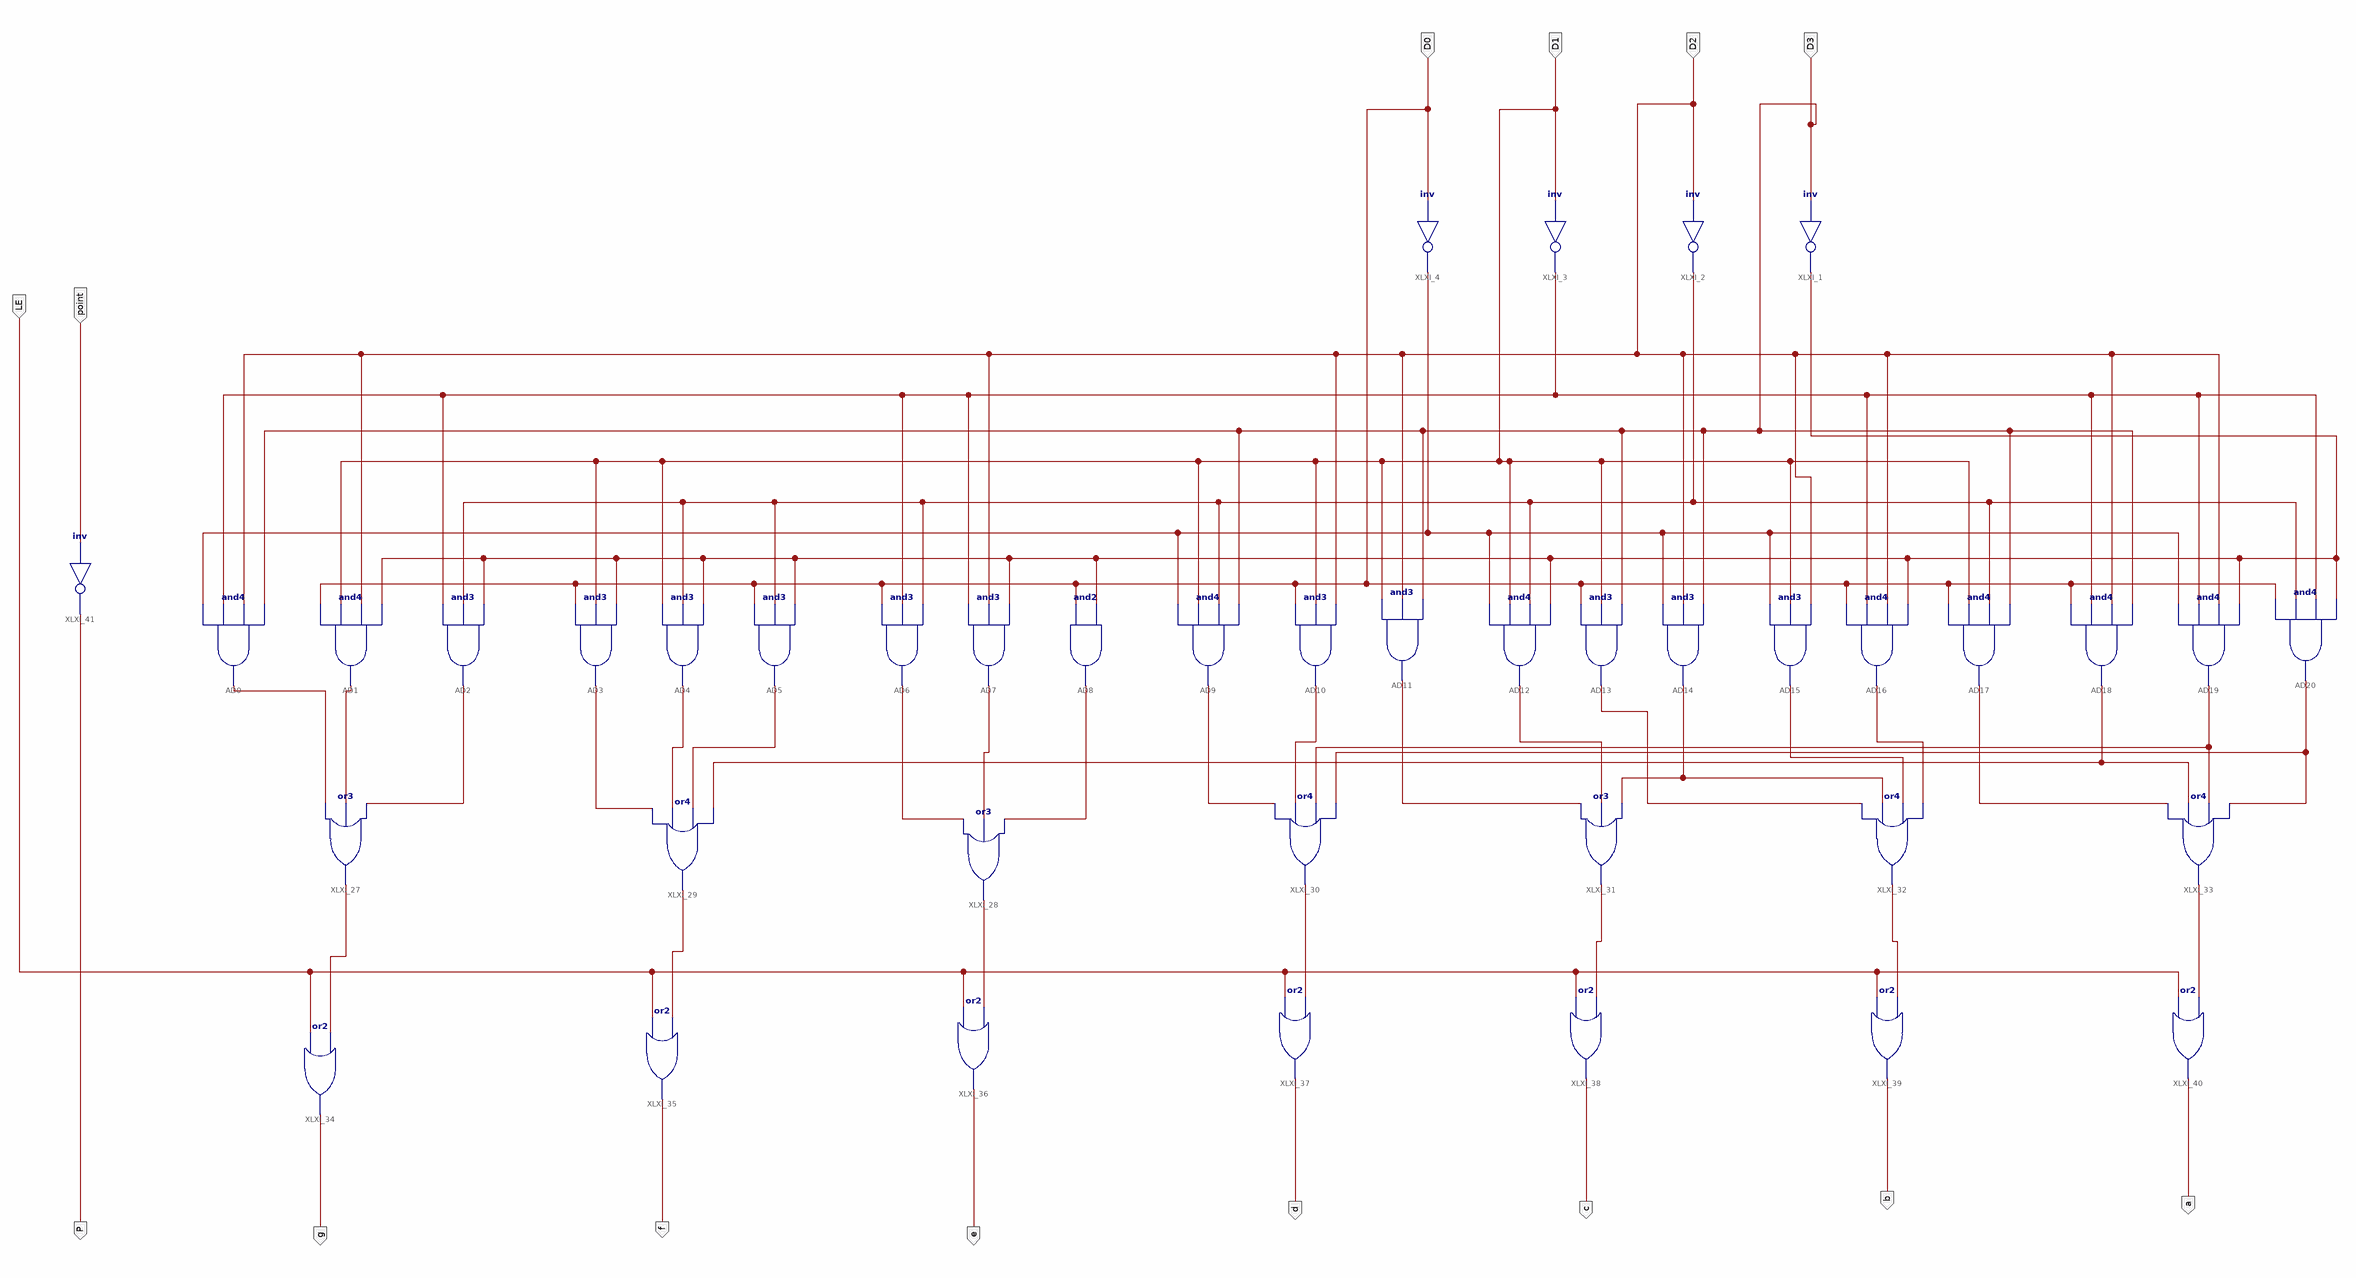
[diagram p0: schematic sheet 1]
// Xilinx ISE schematic MyMC14495.sch (kintex7) as structural Verilog: 40 symbols, 14 ports
module MyMC14495 (
  input  D3,
  input  D0,
  input  LE,
  input  point,
  input  D2,
  input  D1,
  output P,
  output g,
  output f,
  output e,
  output d,
  output c,
  output b,
  output a
);

  wire XLXN_5, XLXN_6, XLXN_8, XLXN_9, XLXN_10, XLXN_12, XLXN_13, XLXN_14, XLXN_15, XLXN_16, XLXN_17,
       XLXN_18, XLXN_25, XLXN_26, XLXN_27, XLXN_28, XLXN_29, XLXN_30, XLXN_31, XLXN_32, XLXN_33, XLXN_38,
       XLXN_39, XLXN_40, XLXN_41, XLXN_42, XLXN_43, XLXN_44, XLXN_54, XLXN_57, XLXN_59, XLXN_62;

  not XLXI_1 (XLXN_54, D3);
  not XLXI_2 (XLXN_57, D2);
  not XLXI_3 (XLXN_59, D1);
  not XLXI_4 (XLXN_62, D0);
  and AD0 (XLXN_5, XLXN_62, XLXN_59, D2, D3);
  and AD1 (XLXN_6, D0, D1, D2, XLXN_54);
  and AD2 (XLXN_8, XLXN_59, XLXN_57, XLXN_54);
  and AD3 (XLXN_9, D0, D1, XLXN_54);
  and AD4 (XLXN_10, D1, XLXN_57, XLXN_54);
  and AD5 (XLXN_16, D0, XLXN_57, XLXN_54);
  and AD6 (XLXN_13, D0, XLXN_59, XLXN_57);
  and AD7 (XLXN_14, XLXN_59, D2, XLXN_54);
  and AD8 (XLXN_15, D0, XLXN_54);
  and AD9 (XLXN_17, XLXN_62, D1, XLXN_57, D3);
  and AD10 (XLXN_18, D0, D1, D2);
  and AD11 (XLXN_32, D1, D2, D3);
  and AD12 (XLXN_33, XLXN_62, D1, XLXN_57, XLXN_54);
  and AD13 (XLXN_31, D0, D1, D3);
  and AD14 (XLXN_30, XLXN_62, D2, D3);
  and AD15 (XLXN_29, XLXN_62, D1, D2);
  and AD16 (XLXN_28, D0, XLXN_59, D2, XLXN_54);
  and AD17 (XLXN_27, D0, D1, XLXN_57, D3);
  and AD18 (XLXN_12, D0, XLXN_59, D2, D3);
  and AD19 (XLXN_26, XLXN_62, XLXN_59, D2, XLXN_54);
  and AD20 (XLXN_25, D0, XLXN_57, XLXN_59, XLXN_54);
  or XLXI_27 (XLXN_44, XLXN_5, XLXN_6, XLXN_8);
  or XLXI_28 (XLXN_42, XLXN_13, XLXN_14, XLXN_15);
  or XLXI_29 (XLXN_43, XLXN_9, XLXN_10, XLXN_16, XLXN_12);
  or XLXI_30 (XLXN_41, XLXN_17, XLXN_18, XLXN_26, XLXN_25);
  or XLXI_31 (XLXN_40, XLXN_32, XLXN_33, XLXN_30);
  or XLXI_32 (XLXN_39, XLXN_31, XLXN_30, XLXN_29, XLXN_28);
  or XLXI_33 (XLXN_38, XLXN_27, XLXN_12, XLXN_26, XLXN_25);
  or XLXI_34 (g, LE, XLXN_44);
  or XLXI_35 (f, LE, XLXN_43);
  or XLXI_36 (e, LE, XLXN_42);
  or XLXI_37 (d, LE, XLXN_41);
  or XLXI_38 (c, LE, XLXN_40);
  or XLXI_39 (b, LE, XLXN_39);
  or XLXI_40 (a, LE, XLXN_38);
  not XLXI_41 (P, point);
endmodule
